# Altium schematic sheet SchemaSuperstar.SchDoc
size A4; SheetNumber: 1; SheetTotal: 1
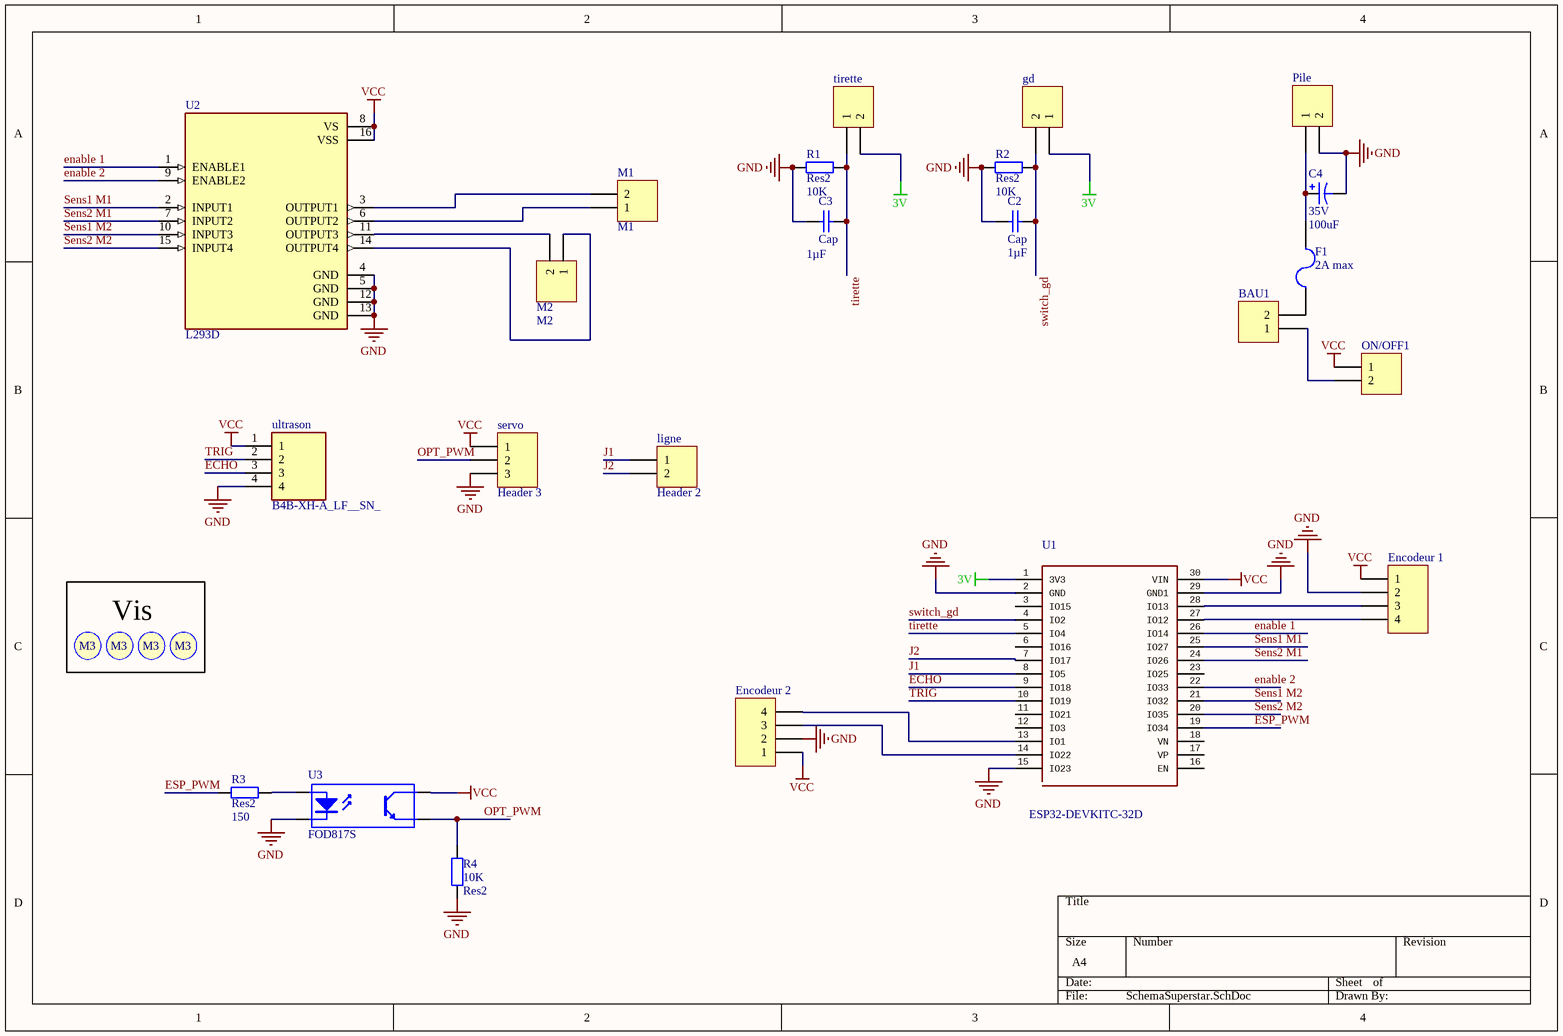
[diagram p0: SchemaSuperstar.SchDoc]

## Parts
BAU1  (no value)  [S2B-XH-A]
C2  Cap  value 1µF  [Capacitor 1206]
C3  Cap  value 1µF  [Capacitor 1206]
C4  35V  value 100uF  [Condensateur]
Encodeur_1  (no value)  [B4BXHALFSN]
Encodeur_2  (no value)  [B4BXHALFSN]
F1  2A max  [PIN-W2/E2.8]
gd  (no value)  [S2B-XH-A]
ligne  Header 2  [HDR1X2]
M1  M1  [S2B-XH-A]
M2  M2  [S2B-XH-A]
ON/OFF1  (no value)  [S2B-XH-A]
Pile  (no value)  [S2B-XH-A]
R1  Res2  value 10K  [Resistor 1206]
R2  Res2  value 10K  [Resistor 1206]
R3  Res2  value 150  [Resistor 1206]
R4  Res2  value 10K  [Resistor 1206]
S1  Screw M3  [Screw M3]  (value not drawn)
S2  Screw M3  [Screw M3]  (value not drawn)
S3  Screw M3  [Screw M3]  (value not drawn)
S4  Screw M3  [Screw M3]  (value not drawn)
servo  Header 3  [HDR1X3]
tirette  (no value)  [S2B-XH-A]
U1  ESP32-DEVKITC-32D  [MODULE_ESP32-DEVKITV1]
U2  L293D  [DIP880W50P254L2000H510Q16]
U3  FOD817S  [SOP254P1016X385-4N]
ultrason  B4B-XH-A_LF__SN_  [B4BXHALFSN]

## Nets
3V: gd.1 tirette.2 U1.1(3V3)
GND: C2.1 C3.1 C4.2 Encodeur_1.2 Encodeur_2.2 Pile.2 R1.1 R2.1 R4.1 servo.3 U1.2(GND) U1.15(IO23) U1.29(GND1) U2.4(GND) U2.5(GND) U2.12(GND) U2.13(GND) U3.2(K) ultrason.4
VCC: Encodeur_1.1 Encodeur_2.1 ON/OFF1.1 servo.1 U1.30(VIN) U2.8(VS) U2.16(VSS) U3.4(C) ultrason.1
ECHO: U1.9(IO18) ultrason.3
enable 1: U1.26(IO14) U2.1(ENABLE1)
enable 2: U1.22(IO33) U2.9(ENABLE2)
ESP_PWM: R3.1 U1.19(IO34)
J1: ligne.1 U1.8(IO5)
J2: ligne.2 U1.7(IO17)
OPT_PWM: R4.2 servo.2 U3.3(E)
Sens1 M1: U1.25(IO27) U2.2(INPUT1)
Sens1 M2: U1.21(IO32) U2.10(INPUT3)
Sens2 M1: U1.24(IO26) U2.7(INPUT2)
Sens2 M2: U1.20(IO35) U2.15(INPUT4)
switch_gd: C2.2 gd.2 R2.2 U1.4(IO2)
tirette: C3.2 R1.2 tirette.1 U1.5(IO4)
TRIG: U1.10(IO19) ultrason.2
NetBAU1_1: BAU1.1 ON/OFF1.2
NetBAU1_2: BAU1.2 F1.1
NetC4_1: C4.1 F1.2 Pile.1
NetEncodeur_1_3: Encodeur_1.3 U1.28(IO13)
NetEncodeur_1_4: Encodeur_1.4 U1.27(IO12)
NetEncodeur_2_3: Encodeur_2.3 U1.14(IO22)
NetEncodeur_2_4: Encodeur_2.4 U1.13(IO1)
NetM1_1: M1.1 U2.6(OUTPUT2)
NetM1_2: M1.2 U2.3(OUTPUT1)
NetM2_1: M2.1 U2.14(OUTPUT4)
NetM2_2: M2.2 U2.11(OUTPUT3)
NetR3_2: R3.2 U3.1(A)

Not connected (* = marked no-connect by the designer): U1 3(IO15) 6(IO16) 11(IO21) 12(IO3) 16(EN) 17(VP) 18(VN) 23(IO25)

## Notes on the sheet
- Vis
- (in symbol Screw M3) M3

## Library data of the parts
BAU1 gd M1 M2 ON/OFF1 Pile tirette = Header 2H: Header, 2-Pin, Right Angle; LatestRevisionDate: 17-Jul-2002; LatestRevisionNote: Re-released for DXP Platform.; Publisher: Altium Limited
C2 C3 = Cap: Capacitor; Published: 8-Jun-2000; LatestRevisionDate: 17-Jul-2002; LatestRevisionNote: Re-released for DXP Platform.; PackageReference: RAD-0.3; Publisher: Altium Limited; PackageDescription: Radial Cap, Thru-Hole; 2 Leads; 0.3 in Pin Spacing
C4 = Cap Pol1: Polarized Capacitor (Radial); Published: 8-Jun-2000; LatestRevisionDate: 17-Jul-2002; LatestRevisionNote: Re-released for DXP Platform.; PackageReference: RB7.6-15; Publisher: Altium Limited; PackageDescription: Polarized Capacitor (Radial); 2 Leads
Encodeur_1 Encodeur_2 = Header 4H: Header, 4-Pin, Right Angle; LatestRevisionDate: 17-Jul-2002; LatestRevisionNote: Re-released for DXP Platform.; Publisher: Altium Limited
F1 = Fuse 2: Fuse; Published: 8-Jun-2000; LatestRevisionDate: 17-Jul-2002; LatestRevisionNote: Re-released for DXP Platform.; PackageReference: PIN-W2/E2.8; Publisher: Altium Limited; PackageDescription: Thru-Hole; 2 Leads
ligne = Header 2: Header, 2-Pin; LatestRevisionDate: 17-Jul-2002; LatestRevisionNote: Re-released for DXP Platform.; Publisher: Altium Limited
R1-R4 = Res2: Resistor; Published: 8-Jun-2000; LatestRevisionDate: 17-Jul-2002; LatestRevisionNote: Re-released for DXP Platform.; PackageReference: AXIAL-0.4; Publisher: Altium Limited; PackageDescription: Axial Device, Thru-Hole; 2 Leads; 0.4 in Pin Spacing
servo = Header 3: Header, 3-Pin; LatestRevisionDate: 17-Jul-2002; LatestRevisionNote: Re-released for DXP Platform.; Publisher: Altium Limited
U1 = ESP32-DEVKITC-32D: Eval Board For Esp-Wroom-32; MF: Espressif Systems; Availability: Unavailable; Package: None; SnapEDA_Link: https://www.snapeda.com/parts/ESP32-DEVKITC-32D/Espressif%20Systems/view-part/?ref=snap; MP: ESP32-DEVKITC-32D; Price: None; Value: *
U2 = L293D: Bipolar Motor Driver - Parallel 16-PowerDIP; MF: STMicroelectronics; MP: L293D; Package: DIP-16 STMicroelectronics; SnapEDA_Link: https://www.snapeda.com/parts/L293D/STMicroelectronics/view-part/?ref=snap; Purchase-URL: https://pricing.snapeda.com/search/part/L293D/?ref=eda; Check_prices: https://www.snapeda.com/parts/L293D/STMicroelectronics/view-part/?ref=eda; Availability: In Stock; Value: *; Price: None
U3 = Optoisolator1: 4-Pin Phototransistor Optocoupler; Published: 24-Mar-1999; LatestRevisionDate: 04-Mar-2005; LatestRevisionNote: Sch pins 3 & 4 Swapped.; DatasheetVersion: Nov-2003; PackageReference: DIP-4; Publisher: Altium Limited
ultrason = B4B-XH-A_LF__SN_: Connector; Manufacturer_Name: JST (JAPAN SOLDERLESS TERMINALS); Manufacturer_Part_Number: B4B-XH-A(LF)(SN); Datasheet Link: https://datasheet.lcsc.com/szlcsc/JST-Sales-America-B4B-XH-A-LF-SN_C144395.pdf; Height: 7mm; Arrow Part Number: B4B-XH-A(LF)(SN); Arrow Price/Stock: https://www.arrow.com/en/products/b4b-xh-a-lf-sn/jst-manufacturing?region=europe